# Altium schematic sheet Sheet1.SchDoc
size A4; SheetNumber: 1; SheetTotal: 2
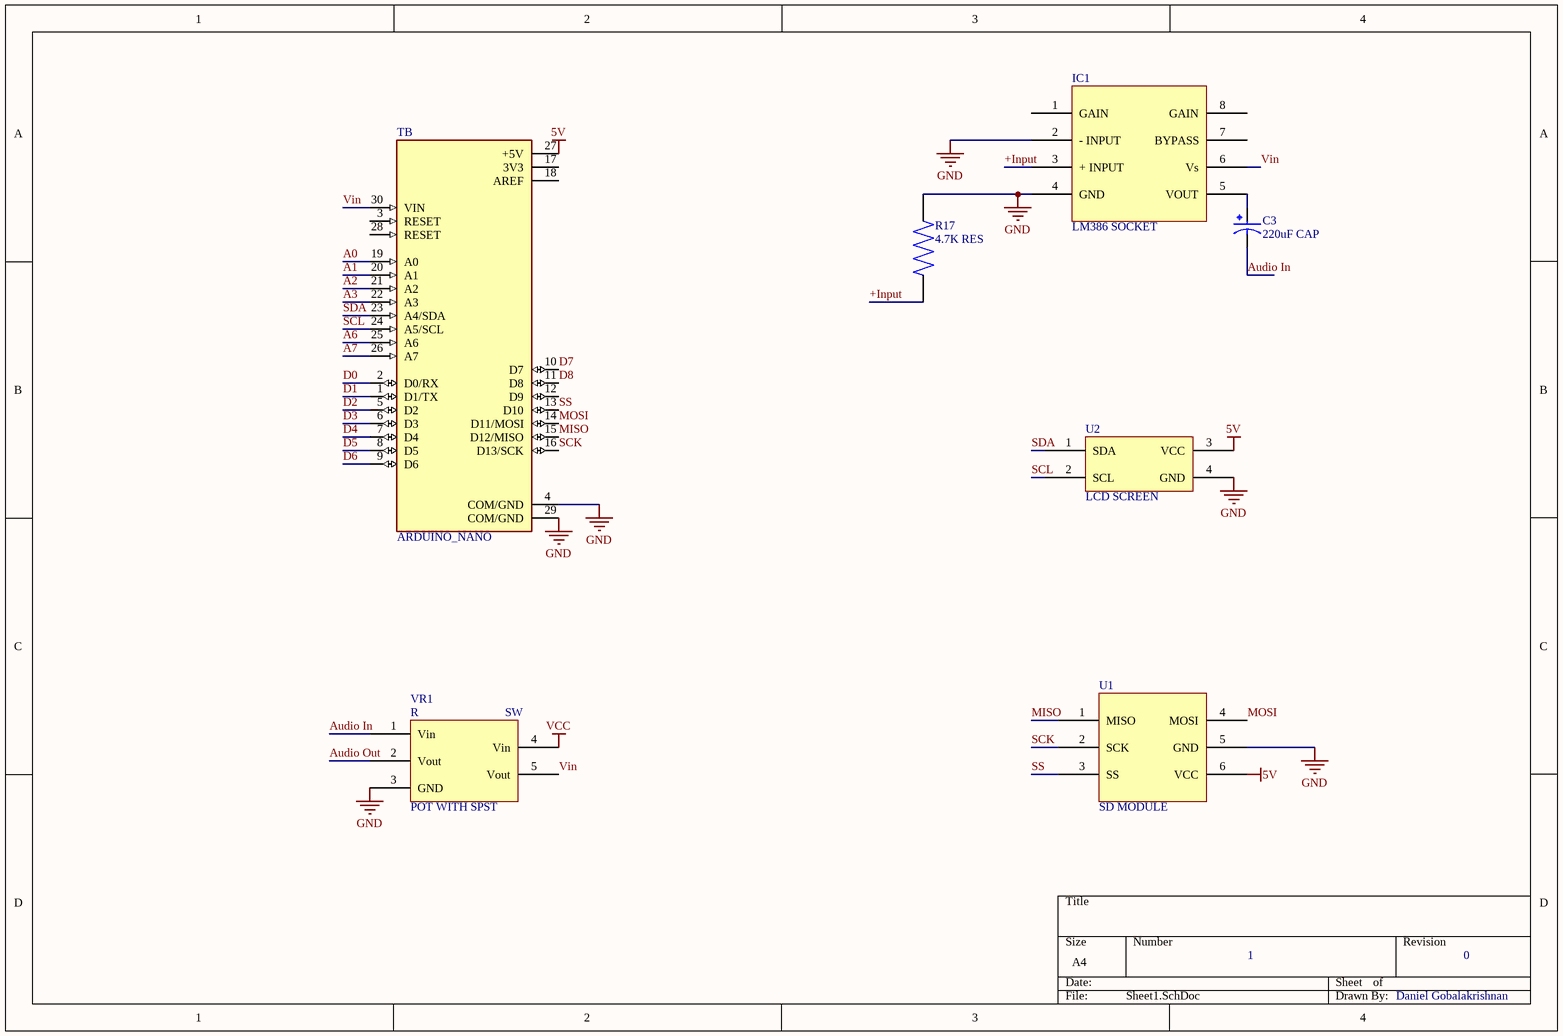
[diagram p0: Sheet1.SchDoc]

## Parts
C3  220uF CAP  [220uF CAP]
IC1  LM386 SOCKET  [LM386 SOCKET]
R17  4.7K RES  [4.7K RES]
TB  ARDUINO_NANO  [SHIELD_ARDUINO_NANO]
U1  SD MODULE  [SD MODULE]
U2  LCD SCREEN  [LCD SCREEN]
VR1  POT WITH SPST  [POT WITH SPST]

## Nets
5V: TB.27(+5V) U1.6(VCC) U2.3(VCC)
GND: IC1.2(-_INPUT) IC1.4(GND) R17.2 TB.4(COM/GND) TB.29(COM/GND) U1.5(GND) U2.4(GND) VR1.3(GND)
VCC: VR1.4(Vin)
+Input: IC1.3(+_INPUT) R17.1
A0: TB.19(A0)
A1: TB.20(A1)
A2: TB.21(A2)
A3: TB.22(A3)
A6: TB.25(A6)
A7: TB.26(A7)
Audio In: C3.N VR1.1(Vin)
Audio Out: VR1.2(Vout)
D0: TB.2(D0/RX)
D1: TB.1(D1/TX)
D2: TB.5(D2)
D3: TB.6(D3)
D4: TB.7(D4)
D5: TB.8(D5)
D6: TB.9(D6)
D7: TB.10(D7)
D8: TB.11(D8)
MISO: TB.15(D12/MISO) U1.1(MISO)
MOSI: TB.14(D11/MOSI) U1.4(MOSI)
SCK: TB.16(D13/SCK) U1.2(SCK)
SCL: TB.24(A5/SCL) U2.2(SCL)
SDA: TB.23(A4/SDA) U2.1(SDA)
SS: TB.13(D10) U1.3(SS)
Vin: IC1.6(Vs) TB.30(VIN) VR1.5(Vout)
NetC3_P: C3.P IC1.5(VOUT)

Not connected (* = marked no-connect by the designer): IC1 1(GAIN) 7(BYPASS) 8(GAIN); TB 3(RESET) 12(D9) 17(3V3) 18(AREF) 28(RESET)

## Notes on the sheet
- 1
- 0
- Daniel Gobalakrishnan
- (in symbol POT WITH SPST) R; SW

## Library data of the parts
C3 = 220uF CAP: 33ÂµF 250V Aluminum Electrolytic Capacitors Radial, Can 5000 Hrs @ 105Â°C; MP: UPM2E330MHD1TN; MF: Nichicon; Price: None; Availability: Warning; Package: Radial Nichicon; SnapEDA_Link: https://www.snapeda.com/parts/UPM2E330MHD1TN/Nichicon/view-part/2353634/?ref=snap; Check_prices: https://www.snapeda.com/parts/UPM2E330MHD1TN/Nichicon/view-part/2353634/?ref=eda; Value: *; Purchase-URL: https://pricing.snapeda.com/search/part/UPM2E330MHD1TN/?ref=eda
IC1 = LM386 SOCKET: 8 pin IC socket for LM386
R17 = 4.7K RES: MP: RMCF1206FT4K70; Package: None; Price: None; Value: *; Availability: Unavailable
TB = ARDUINO_NANO: ATSAMD21G18A Arduino Nano 33 IoT SAM D ARMÂ® CortexÂ®-M0+ MCU 32-Bit Embedded Evaluation Board; MP: ARDUINO NANO; Package: None; Price: None; Availability: Unavailable; Value: *; MF: Arduino; SnapEDA_Link: https://www.snapeda.com/parts/ARDUINO%20NANO/Arduino/view-part/1128261/?ref=snap
VR1 = POT WITH SPST: Potentiometer with SPST Switch